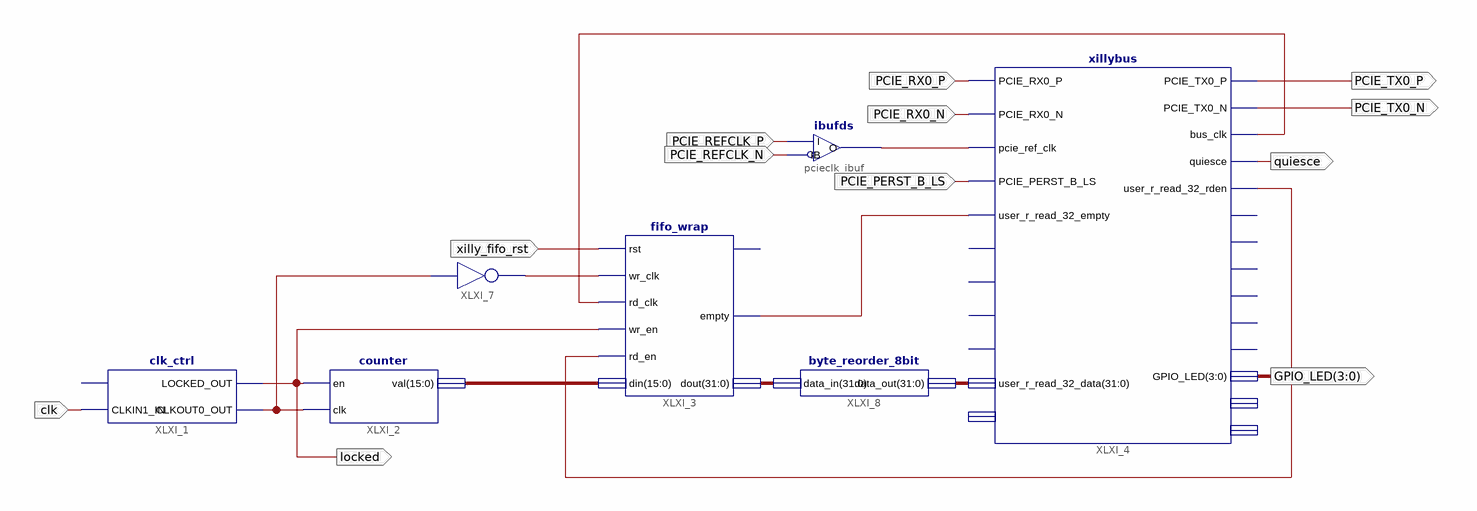
[diagram p0: schematic sheet 1]
// Xilinx ISE schematic xillyctr.sch (virtex5) as structural Verilog: 7 symbols, 12 ports
module xillyctr (
  input  PCIE_RX0_P,
  input  PCIE_RX0_N,
  input  PCIE_PERST_B_LS,
  input  xilly_fifo_rst,
  input  clk,
  input  PCIE_REFCLK_P,
  input  PCIE_REFCLK_N,
  output locked,
  output PCIE_TX0_P,
  output PCIE_TX0_N,
  output quiesce,
  output [3:0] GPIO_LED
);

  wire pcie_ref_clk, XLXN_5, XLXN_7, XLXN_8, XLXN_12, XLXN_13;
  wire [15:0] XLXN_3;
  wire [31:0] XLXN_15, XLXN_16;

  clk_ctrl XLXI_1 (.CLKIN1_IN(clk), .LOCKED_OUT(locked), .CLKOUT0_OUT(XLXN_12));  // open: RST_IN
  counter XLXI_2 (.en(locked), .clk(XLXN_12), .val(XLXN_3));
  fifo_wrap XLXI_3 (
    .rst(xilly_fifo_rst), .wr_clk(XLXN_13), .rd_clk(XLXN_7), .wr_en(locked), .rd_en(XLXN_8), .din(XLXN_3),
    .empty(XLXN_5), .dout(XLXN_15));  // open: full
  xillybus XLXI_4 (
    .PCIE_RX0_P(PCIE_RX0_P), .PCIE_RX0_N(PCIE_RX0_N), .pcie_ref_clk(pcie_ref_clk),
    .PCIE_PERST_B_LS(PCIE_PERST_B_LS), .user_r_read_32_empty(XLXN_5), .user_r_read_32_data(XLXN_16),
    .PCIE_TX0_P(PCIE_TX0_P), .PCIE_TX0_N(PCIE_TX0_N), .bus_clk(XLXN_7), .quiesce(quiesce),
    .user_r_read_32_rden(XLXN_8), .GPIO_LED(GPIO_LED));  // open: user_r_read_32_eof, user_r_mem_8_empty, user_r_mem_8_eof, user_w_mem_8_full, user_r_mem_8_data, user_r_read_32_open, user_r_mem_8_rden, user_r_mem_8_open, user_w_mem_8_wren, user_w_mem_8_open, user_mem_8_addr_update, user_w_mem_8_data, user_mem_8_addr
  ibufds pcieclk_ibuf (.I(PCIE_REFCLK_P), .IB(PCIE_REFCLK_N), .O(pcie_ref_clk));
  not XLXI_7 (XLXN_13, XLXN_12);
  byte_reorder_8bit XLXI_8 (.data_in(XLXN_15), .data_out(XLXN_16));
endmodule
